# EAGLE schematic BadAssbasSSynth (EAGLE 7.6.0)
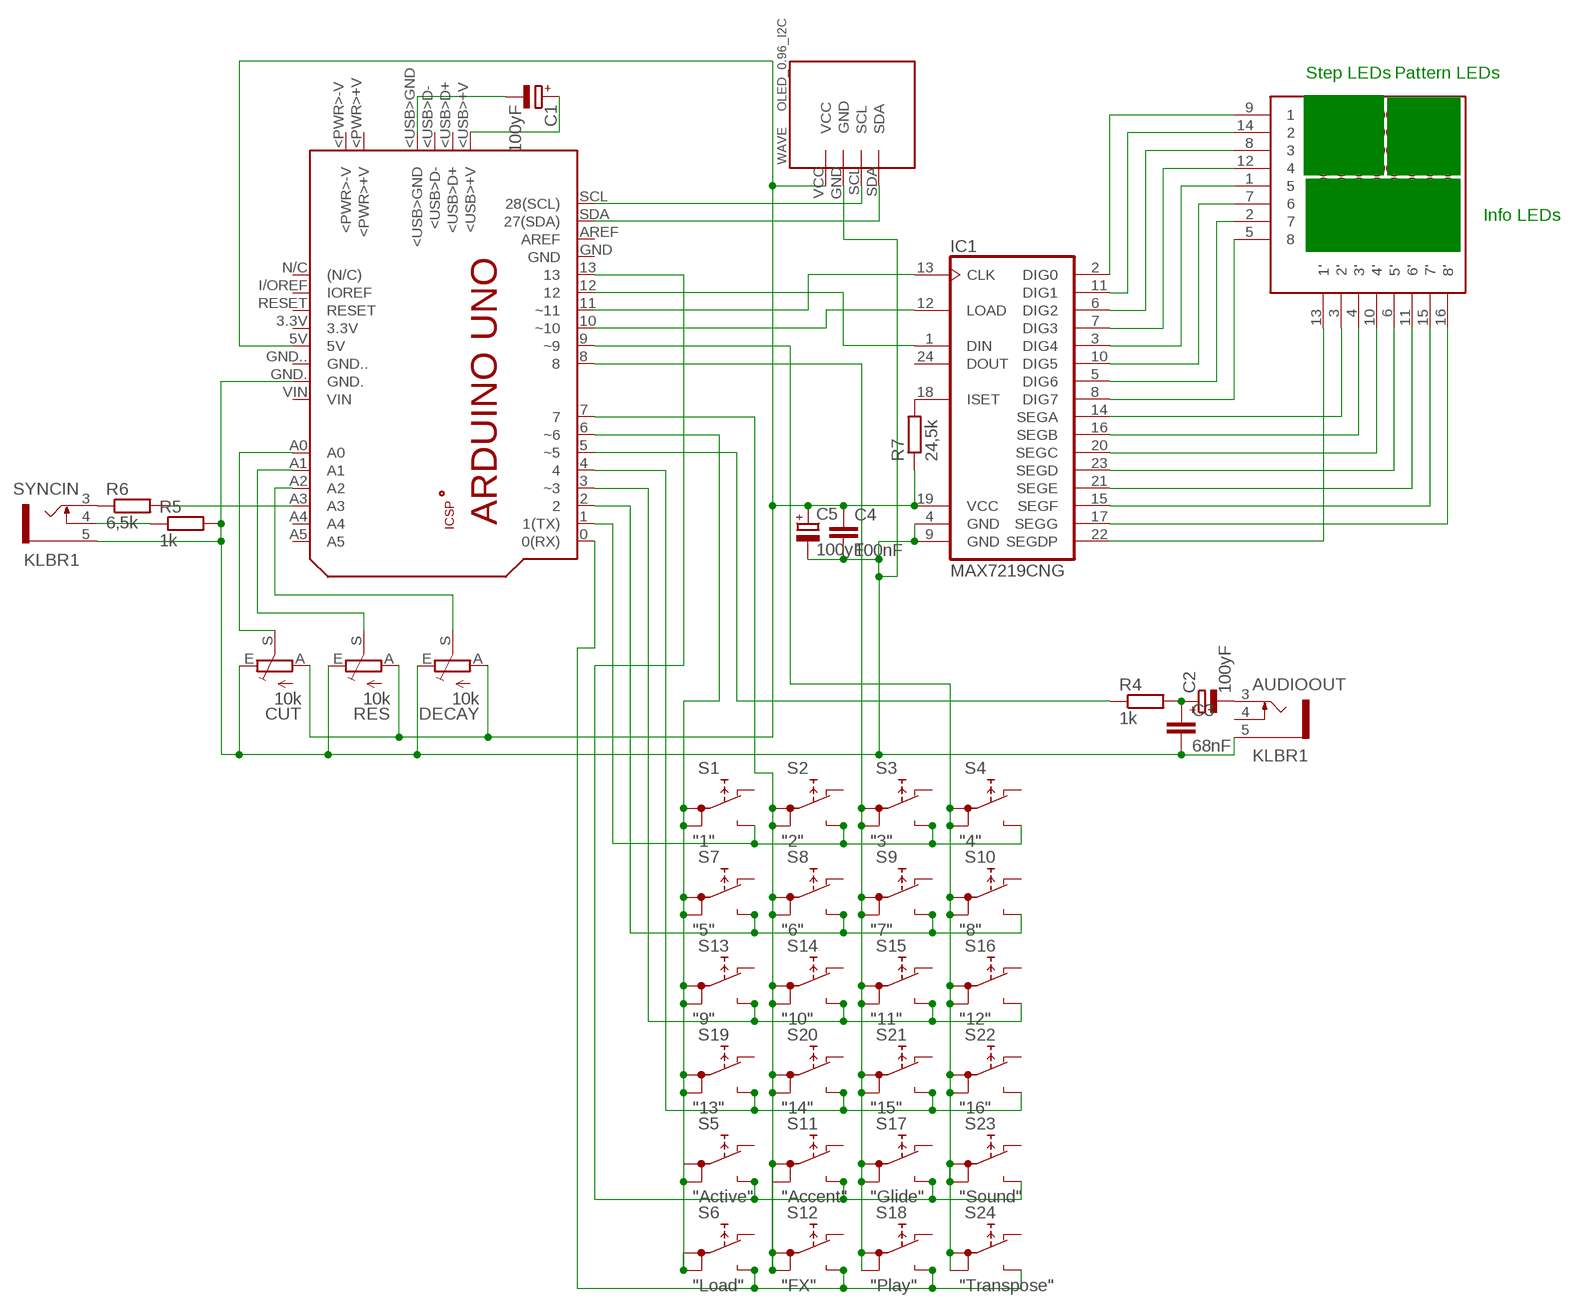
[diagram p0: schematic, sheet 1]

## Parts
AUDIOOUT  KLBR1  [KLBR1]
C1  100yF  CPOL-EUE2,5-6E  [E2,5-6E]
C2  100yF  CPOL-EUE2,5-6E  [E2,5-6E]
C3  68nF  C-EU025-025X050  [C025-025X050]
C4  100nF  C-EU025-025X050  [C025-025X050]
C5  100yF  CPOL-EUE2,5-6E  [E2,5-6E]
CUT  10k  TRIM_EU-CIP20C-6MM  [CIP20C-6MM]
DECAY  10k  TRIM_EU-CIP20C-6MM  [CIP20C-6MM]
IC1  MAX7219CNG  [DIL24-3]
PCB1  ARDUINO_UNO  [ARDUINO_UNO]
R4  1k  R-EU_0204/7  [0204/7]
R5  1k  R-EU_0204/7  [0204/7]
R6  6,5k  R-EU_0204/7  [0204/7]
R7  24,5k  R-EU_0204/7  [0204/7]
RES  10k  TRIM_EU-CIP20C-6MM  [CIP20C-6MM]
S1  "1"  5501  [5501]
S2  "2"  5501  [5501]
S3  "3"  5501  [5501]
S4  "4"  5501  [5501]
S5  "Active"  5501  [5501]
S6  "Load"  5501  [5501]
S7  "5"  5501  [5501]
S8  "6"  5501  [5501]
S9  "7"  5501  [5501]
S10  "8"  5501  [5501]
S11  "Accent"  5501  [5501]
S12  "FX"  5501  [5501]
S13  "9"  5501  [5501]
S14  "10"  5501  [5501]
S15  "11"  5501  [5501]
S16  "12"  5501  [5501]
S17  "Glide"  5501  [5501]
S18  "Play"  5501  [5501]
S19  "13"  5501  [5501]
S20  "14"  5501  [5501]
S21  "15"  5501  [5501]
S22  "16"  5501  [5501]
S23  "Sound"  5501  [5501]
S24  "Transpose"  5501  [5501]
SYNCIN  KLBR1  [KLBR1]
U$2  NFM-12881BG-11  [NFM-12881BG-11]
WAVE  OLED_0.96_I2C  [OLED_0.96_I2C]

## Nets
N$1: C2.+ C3.1 R4.2
N$2: AUDIOOUT.3 C2.-
N$3: AUDIOOUT.5 C3.2 C4.2 C5.- CUT.E DECAY.E IC1.4(GND) IC1.9(GND) PCB1.GND. R5.2 RES.E SYNCIN.5 WAVE.GND
N$4: PCB1.5(~5) R4.1
N$5: R5.1 SYNCIN.4
N$6: R6.1 SYNCIN.3
N$7: PCB1.A3 R6.2
N$8: C1.- PCB1.<USB>GND
N$9: C1.+ PCB1.<USB>+V
N$10: C4.1 C5.+ CUT.A DECAY.A IC1.19(VCC) PCB1.5V R7.1 RES.A WAVE.VCC
N$11: PCB1.SCL(28(SCL)) WAVE.SCL
N$12: PCB1.SDA(27(SDA)) WAVE.SDA
N$13: PCB1.13 S5.NO S11.NO S17.NO S23.NO
N$14: PCB1.A1 RES.S
N$15: DECAY.S PCB1.A2
N$16: IC1.1(DIN) PCB1.12
N$17: IC1.13(CLK) PCB1.11(~11)
N$18: IC1.12(LOAD) PCB1.10(~10)
N$19: IC1.18(ISET) R7.2
N$20: IC1.2(DIG0) U$2.9
N$21: IC1.11(DIG1) U$2.14
N$22: IC1.6(DIG2) U$2.8
N$23: IC1.7(DIG3) U$2.12
N$24: IC1.3(DIG4) U$2.1
N$25: IC1.10(DIG5) U$2.7
N$26: IC1.5(DIG6) U$2.2
N$27: IC1.8(DIG7) U$2.5
N$28: IC1.22(SEGDP) U$2.13(1')
N$29: IC1.14(SEGA) U$2.3(2')
N$30: IC1.16(SEGB) U$2.4(3')
N$31: IC1.20(SEGC) U$2.10(4')
N$32: IC1.23(SEGD) U$2.6(5')
N$33: IC1.21(SEGE) U$2.11(6')
N$34: IC1.15(SEGF) U$2.15(7')
N$35: IC1.17(SEGG) U$2.16(8')
N$36: PCB1.6(~6) S1.1A S1.1B S5.1A S5.1B S6.1A S6.1B S7.1A S7.1B S13.1A S13.1B S19.1A S19.1B
N$37: PCB1.7 S2.1A S2.1B S8.1A S8.1B S11.1A S11.1B S12.1A S12.1B S14.1A S14.1B S20.1A S20.1B
N$38: PCB1.8 S3.1A S3.1B S9.1A S9.1B S15.1A S15.1B S17.1A S17.1B S18.1A S18.1B S21.1A S21.1B
N$39: PCB1.9(~9) S4.1A S4.1B S10.1A S10.1B S16.1A S16.1B S22.1A S22.1B S23.1A S23.1B S24.1A S24.1B
N$40: PCB1.1(1(TX)) S1.NO S2.NO S3.NO S4.NO
N$41: PCB1.2 S7.NO S8.NO S9.NO S10.NO
N$42: PCB1.0(0(RX)) S6.NO S12.NO S18.NO S24.NO
N$43: CUT.S PCB1.A0
N$44: PCB1.3(~3) S13.NO S14.NO S15.NO S16.NO
N$45: PCB1.4 S19.NO S20.NO S21.NO S22.NO
Unconnected: AUDIOOUT.4 IC1.24(DOUT) PCB1.3.3V PCB1.+5V PCB1.<PWR>+V PCB1.<PWR>-V PCB1.<USB>D+ PCB1.<USB>D- PCB1.A4 PCB1.A5 PCB1.AREF PCB1.GND PCB1.GND.. PCB1.GND_ PCB1.I/OREF(IOREF) PCB1.MISO PCB1.MOSI PCB1.N/C((N/C)) PCB1.RESET PCB1.RESET. PCB1.SCK PCB1.VIN S1.NC S2.NC S3.NC S4.NC S5.NC S6.NC S7.NC S8.NC S9.NC S10.NC S11.NC S12.NC S13.NC S14.NC S15.NC S16.NC S17.NC S18.NC S19.NC S20.NC S21.NC S22.NC S23.NC S24.NC

## Notes on the sheet
- Step LEDs | Pattern LEDs
- Info LEDs

## Library data of the parts
AUDIOOUT SYNCIN = con-lumberg:KLBR?: Jack connectors according to JISC 6560, 2.5mm / 3.5 mm Klinkensteckverbinder nach JISC 6560, 2.5mm / 3,5 mm Source: http://www.lumberg.com/Produkte/PDFs/KLBR2.pdf www.lumberg.com/Produkte/PDFs/KLBR1.pdf; MPN: KLBR 1; OC_FARNELL: 1200140; OC_NEWARK: 97K2707
C1 C2 C5 = resistor:CPOL-EU: POLARIZED CAPACITOR, European symbol
C3 C4 = resistor:C-EU: CAPACITOR, European symbol
CUT DECAY RES = pot:TRIM_EU-: POTENTIOMETER
IC1 = maxim:MAX7219CNG: LED DISPLAY DRIVER; MF: MAXIM; MPN: MAX7219CNG; OC_FARNELL: 1523914; OC_NEWARK: 34C4018
PCB1 = E14_Arduino_revB:ARDUINO_UNO: Device for representing an Arduino Uno board with a footprint in an EAGLE design. Created by Dave Young for Element14. More EAGLE documentation at: http://www.element14.com/community/community/knode/cadsoft_eagle
R4-R7 = resistor:R-EU_: RESISTOR, European symbol
S1-S24 = switch:55?: PUSHBUTTON SERIES 5500 SWITCHES Source: www.e-switch.com .. 5500.pdf
U$2 = eagle-library-edeca.net-v5:NFM-12881BG-11: Futurlec 8x8 LED Matrix
WAVE = tft_1.8_1.44_oled_0.96:OLED_0.96_I2C